# EAGLE schematic atx_power_control (EAGLE 9.6.1)
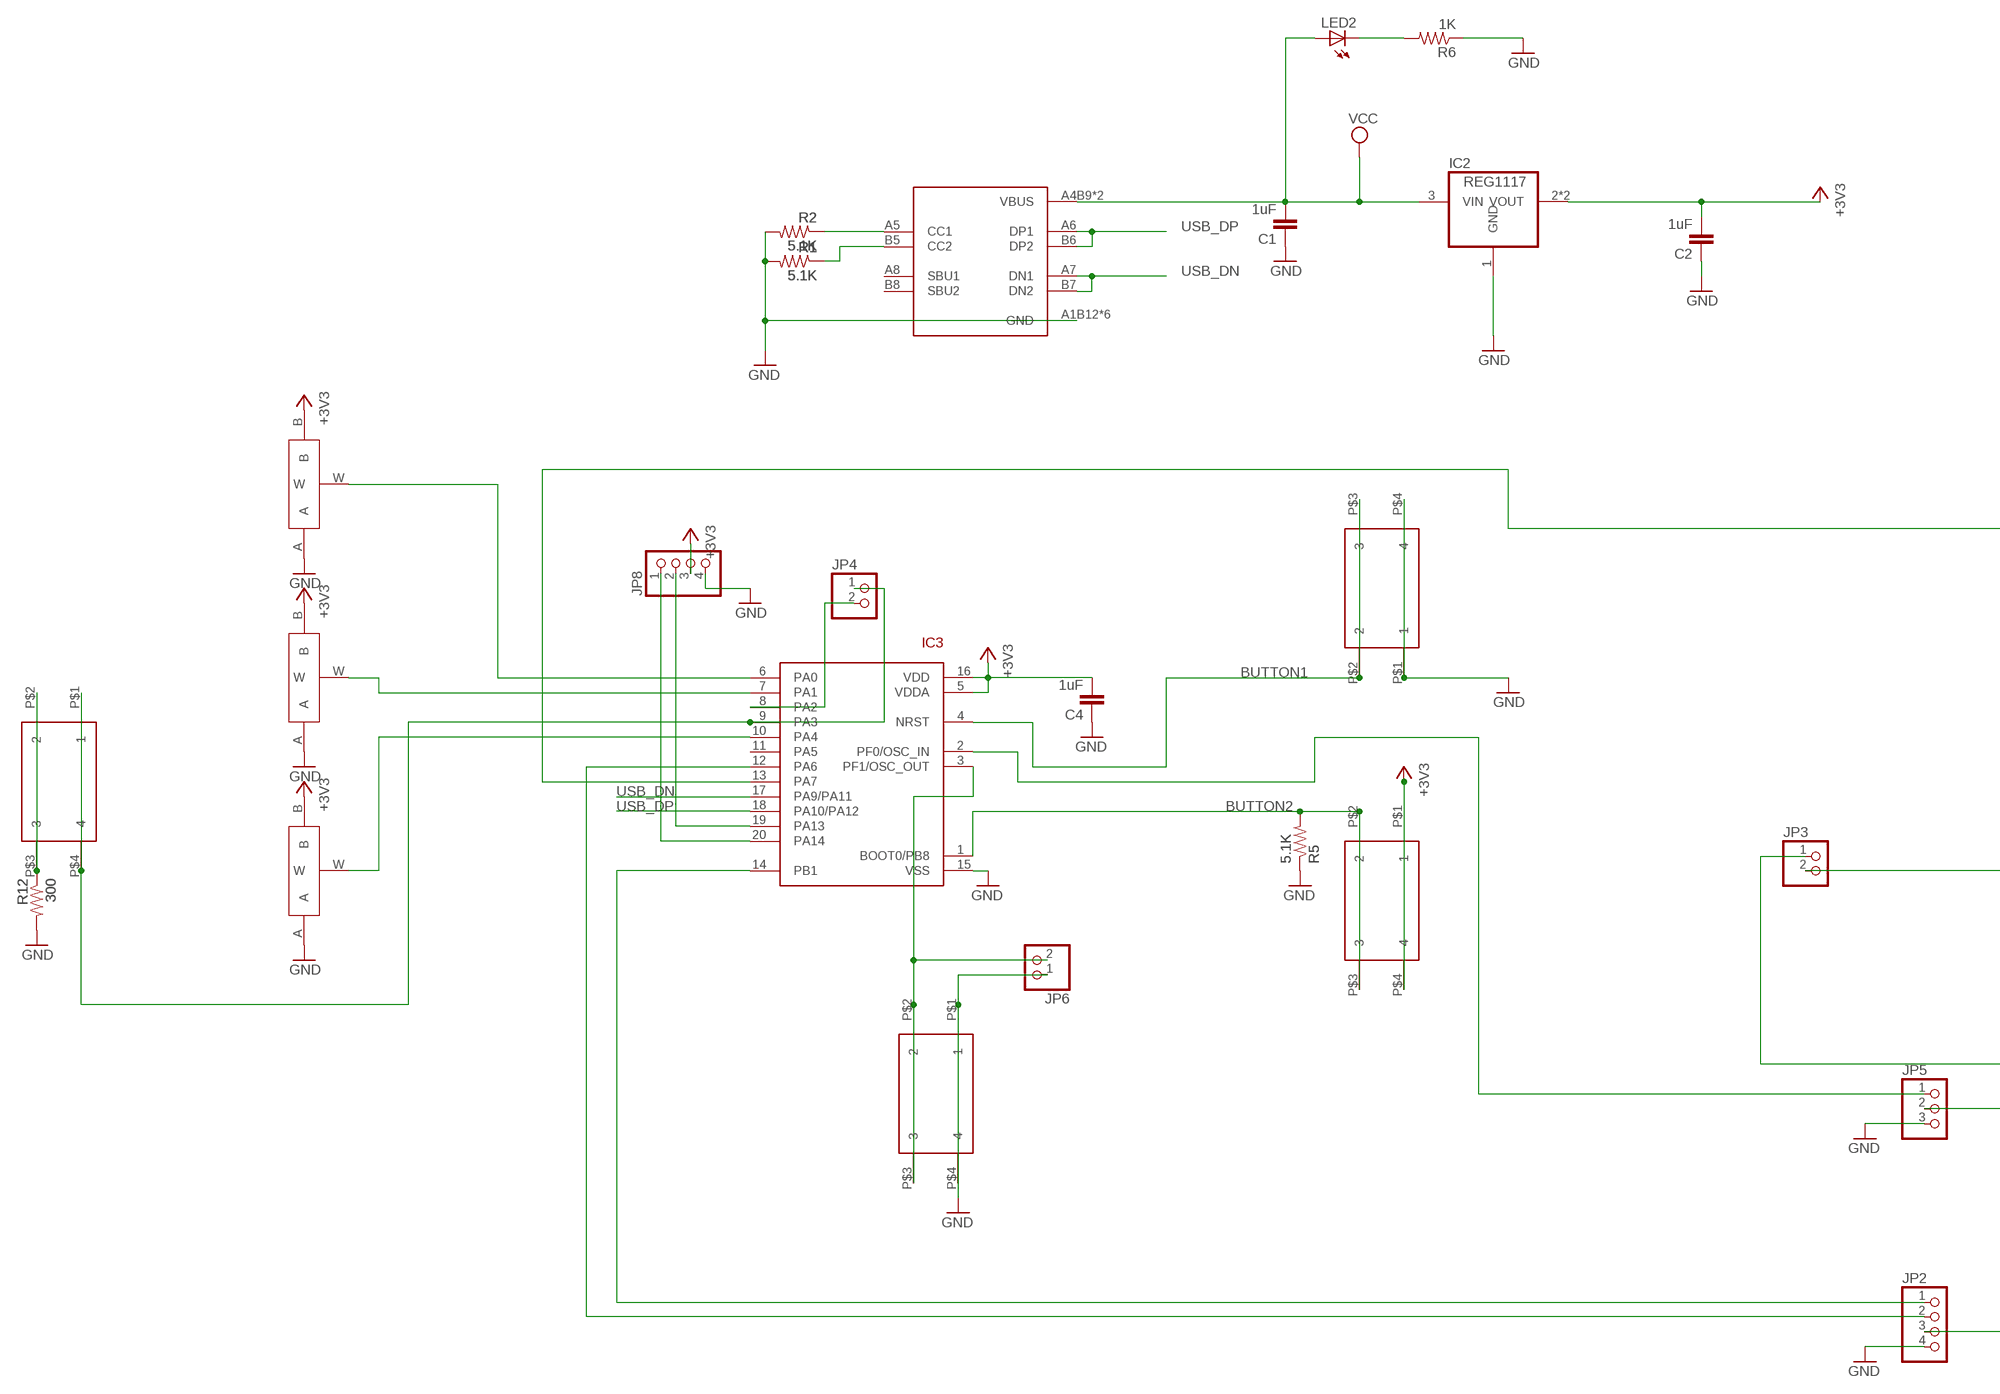
[diagram p0: schematic, sheet 1, part 1 of 2]
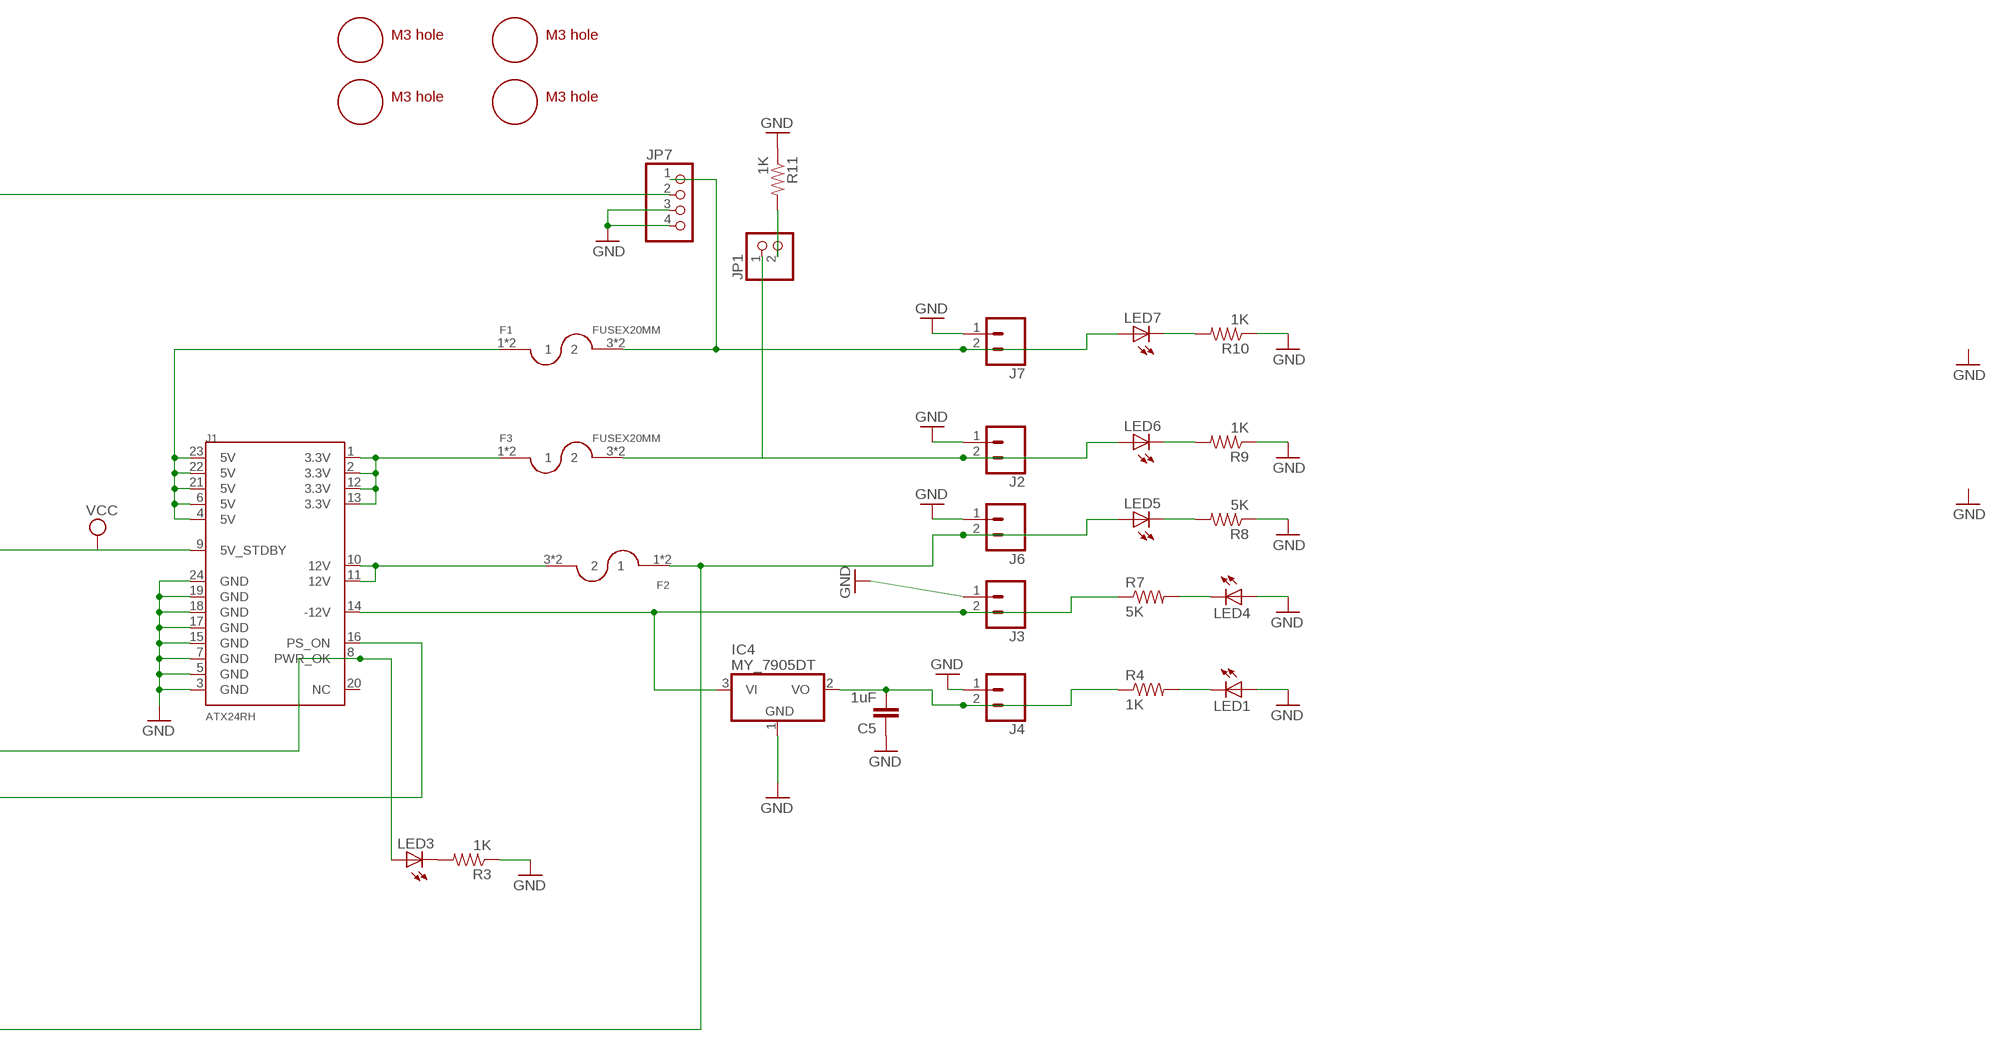
[diagram p1: schematic, sheet 1, part 2 of 2]

## Parts
C1  1uF  CAP0805  [0805@1]
C2  1uF  CAP0805  [0805@1]
C4  1uF  CAP0805  [0805@1]
C5  1uF  CAP0805  [0805@1]
F1  FUSEX20MM  [FUSE_5MM]
F2  FUSEX20MM  [FUSE_5MM]
F3  FUSEX20MM  [FUSE_5MM]
IC2  REG1117  [SOT223]
IC3  STM32F042F4  [TSSOP20]
IC4  MY_7905DT  [ADAFRUIT_TO252]
J1  ATX24RH  [ATX24_RIGHT_ANGLE]
J2  CONN_023.5MM  [SCREWTERMINAL-3.5MM-2]
J3  CONN_023.5MM  [SCREWTERMINAL-3.5MM-2]
J4  CONN_023.5MM  [SCREWTERMINAL-3.5MM-2]
J6  CONN_023.5MM  [SCREWTERMINAL-3.5MM-2]
J7  CONN_023.5MM  [SCREWTERMINAL-3.5MM-2]
JP1  PINHD-1X2  [1X02]
JP2  PINHD-1X4  [1X04]
JP3  PINHD-1X2  [1X02]
JP4  PINHD-1X2  [1X02]
JP5  PINHD-1X3  [1X03]
JP6  PINHD-1X2  [1X02]
JP7  PINHD-1X4  [1X04]
JP8  PINHD-1X4  [1X04]
LED1  LEDCHIP-LED0805  [CHIP-LED0805]
LED2  LEDCHIP-LED0805  [CHIP-LED0805]
LED3  LEDCHIP-LED0805  [CHIP-LED0805]
LED4  LEDCHIP-LED0805  [CHIP-LED0805]
LED5  LEDCHIP-LED0805  [CHIP-LED0805]
LED6  LEDCHIP-LED0805  [CHIP-LED0805]
LED7  LEDCHIP-LED0805  [CHIP-LED0805]
R1  5.1K  RESISTOR0805-RES  [0805]
R2  5.1K  RESISTOR0805-RES  [0805]
R3  1K  RESISTOR0805-RES  [0805]
R4  1K  RESISTOR0805-RES  [0805]
R5  5.1K  RESISTOR0805-RES  [0805]
R6  1K  RESISTOR0805-RES  [0805]
R7  5K  RESISTOR0805-RES  [0805]
R8  5K  RESISTOR0805-RES  [0805]
R9  1K  RESISTOR0805-RES  [0805]
R10  1K  RESISTOR0805-RES  [0805]
R11  1K  RESISTOR0805-RES  [0805]
R12  300  RESISTOR0805-RES  [0805]
SW1  324_SW  [342_SWICH_FOOT]
SW2  324_SW  [342_SWICH_FOOT]
SW3  324_SW  [342_SWICH_FOOT]
SW4  324_SW  [342_SWICH_FOOT]
U2  USBC_16P  [USBC_16P_FOOT]
U$1  M3_MOUNTING_HOLE  [M3_MOUNTING_HOLE_PACK]
U$2  M3_MOUNTING_HOLE  [M3_MOUNTING_HOLE_PACK]
U$3  M3_MOUNTING_HOLE  [M3_MOUNTING_HOLE_PACK]
U$4  3386P  [3386P]
U$5  3386P  [3386P]
U$6  3386P  [3386P]
U$10  M3_MOUNTING_HOLE  [M3_MOUNTING_HOLE_PACK]

## Nets
+3V3: C2.2 C4.2 IC2.2(VOUT) IC2.4(VOUT) IC3.5(VDDA) IC3.16(VDD) JP8.3 SW4.P$1 SW4.P$4 U$4.B U$5.B U$6.B
BUTTON1: IC3.4(NRST) SW3.P$2 SW3.P$3
BUTTON2: IC3.1(BOOT0/PB8) R5.2 SW4.P$2 SW4.P$3
GND: C1.1 C2.1 C4.1 C5.1 IC2.1(GND) IC3.15(VSS) IC4.1(GND) J1.3(GND) J1.5(GND) J1.7(GND) J1.15(GND) J1.17(GND) J1.18(GND) J1.19(GND) J1.24(GND) J2.1 J3.1 J4.1 J6.1 J7.1 JP2.4 JP5.3 JP6.1 JP7.3 JP7.4 JP8.4 LED1.A LED4.A R1.2 R2.2 R3.1 R5.1 R6.1 R8.1 R9.1 R10.1 R11.1 R12.2 SW1.P$1 SW1.P$4 SW3.P$1 SW3.P$4 U2.A1B12(GND) U2.B11A12(GND) U2.P$13(GND) U2.P$14(GND) U2.P$15(GND) U2.P$16(GND) U$4.A U$5.A U$6.A
N$1: LED3.C R3.2
N$2: IC4.3(VI) J1.14(-12V) J3.2 R7.1
N$3: IC3.20(PA14) JP8.1
N$4: IC3.19(PA13) JP8.2
N$5: LED1.C R4.2
N$6: IC3.12(PA6) JP2.2
N$7: IC3.14(PB1) JP2.1
N$8: LED4.C R7.2
N$9: LED5.C R8.2
N$10: F1.1 F1.2 J1.4(5V) J1.6(5V) J1.21(5V) J1.22(5V) J1.23(5V)
N$11: C5.2 IC4.2(VO) J4.2 R4.1
N$12: F3.1 F3.2 J1.1(3.3V) J1.2(3.3V) J1.12(3.3V) J1.13(3.3V)
N$13: IC3.6(PA0) U$4.W
N$14: IC3.13(PA7) JP7.2
N$15: F1.3 F1.4 J7.2 JP7.1 LED7.A
N$16: F2.1 F2.2 J6.2 JP2.3 LED5.A
N$17: JP1.2 R11.2
N$18: LED6.C R9.2
N$19: F3.3 F3.4 J2.2 JP1.1 LED6.A
N$20: LED7.C R10.2
N$21: F2.3 F2.4 J1.10(12V) J1.11(12V)
N$22: IC3.7(PA1) U$5.W
N$23: IC3.10(PA4) U$6.W
N$24: IC3.2(PF0/OSC_IN) JP5.1
N$25: J1.16(PS_ON) JP5.2
N$26: IC3.3(PF1/OSC_OUT) JP6.2 SW1.P$2 SW1.P$3
N$27: IC3.8(PA2) JP4.2
N$28: J1.8(PWR_OK) JP3.1 LED3.A
N$29: LED2.C R6.2
N$30: IC3.9(PA3) JP4.1 SW2.P$1 SW2.P$4
N$31: R1.1 U2.B5(CC2)
N$32: R12.1 SW2.P$2 SW2.P$3
N$33: R2.1 U2.A5(CC1)
USB_DN: IC3.17(PA9/PA11) U2.A7(DN1) U2.B7(DN2)
USB_DP: IC3.18(PA10/PA12) U2.A6(DP1) U2.B6(DP2)
VCC: C1.2 IC2.3(VIN) J1.9(5V_STDBY) JP3.2 LED2.A U2.A4B9(VBUS) U2.B4A9(VBUS)
Unconnected: IC3.11(PA5) J1.20(NC) U2.A8(SBU1) U2.B8(SBU2)

## Library data of the parts
C1 C2 C4 C5 = clock:CAP: Capacitor Standard 0603 ceramic capacitor, and 0.1" leaded capacitor.
F1-F3 = atx_power_control:FUSE
IC2 = clock:REG1117: 800mA and 1A Low Dropout (LDO) Positive Regulator 1.8V, 2.5V, 2.85V, 3.3V, 5V, and Adj; MPN: REG1117; OC_FARNELL: 1097566; OC_NEWARK: 14P6981
IC3 = tx:STM32F042F4
IC4 = atx_power_control:MY_7905: Positive VOLTAGE REGULATOR Added bigger pads to the TO-92 package
J1 = SparkFun-Connectors:ATX24: ATX24 Pin Power Supply Connector This is a good connector for connecting a computer power supply to a PCB. It's massive, but provides many amps of power at 5V and 12V. SKU: PRT-09498
J2-J4 J6 J7 = atx_power_control:CONN_02: Multi connection point. Often used as Generic Header-pin footprint for 0.1 inch spaced/style header connections On any of the 0.1 inch spaced packages, you can populate with these: Break Away Headers - Straight <https://www.sparkfun.com/products/116> (PRT-00116) Break Away Male Headers - Right Angle <https://www.sparkfun.com/products/553> (PRT-00553) Female Headers <https://www.sparkfun.com/products/115> (PRT-00115) Break Away Headers - Machine Pin <https://www.sparkfun.com/products/117> (PRT-00117) Break Away Female Headers - Swiss Machine Pin <https://www.sparkfun.com/products/743> (PRT-00743) For SCREWTERMINALS and SPRING TERMINALS visit here: Screw Terimnals on SparkFun.com <https://www.sparkfun.com/search/results?term=Screw+Terminals> (5mm/3.5mm/2.54mm spacing) This device is also useful as a general connection point to wire up your design to another part of your project. Our various solder wires solder well into these plated through hole pads. Hook-Up Wire - Assortment (Stranded, 22 AWG) <https://www.sparkfun.com/products/11375> (PRT-11375) Hook-Up Wire - Assortment (Solid Core, 22 AWG) <https://www.sparkfun.com/products/11367> (PRT-11367) View the entire wire category on our website here <https://www.sparkfun.com/categories/141> Special notes: Molex polarized connector foot print use with: PRT-08233 with associated crimp pins and housings. 2.54_SCREWTERM for use with PRT-10571. 3.5mm Screw Terminal footprints for PRT-08084 5mm Screw Terminal footprints for use with PRT-08432; PROD_ID: CONN-08399
JP1 JP3 JP4 JP6 = pinhead:PINHD-1X2: PIN HEADER
JP2 JP7 JP8 = pinhead:PINHD-1X4: PIN HEADER
JP5 = pinhead:PINHD-1X3: PIN HEADER
LED1-LED7 = adafruit:LED: LED OSRAM: - CHIPLED LG R971, LG N971, LY N971, LG Q971, LY Q971, LO R971, LY R971 LH N974, LH R974 LS Q976, LO Q976, LY Q976 LO Q996 - Hyper CHIPLED LW Q18S LB Q993, LB Q99A, LB R99A - SideLED LS A670, LO A670, LY A670, LG A670, LP A670 LB A673, LV A673, LT A673, LW A673 LH A674 LY A675 LS A676, LA A676, LO A676, LY A676, LW A676 LS A679, LY A679, LG A679 - Hyper Micro SIDELED® LS Y876, LA Y876, LO Y876, LY Y876 LT Y87S - SmartLED LW L88C, LW L88S LB L89C, LB L89S, LG L890 LS L89K, LO L89K, LY L89K LS L896, LA L896, LO L896, LY L896 - TOPLED LS T670, LO T670, LY T670, LG T670, LP T670 LSG T670, LSP T670, LSY T670, LOP T670, LYG T670 LG T671, LOG T671, LSG T671 LB T673, LV T673, LT T673, LW T673 LH T674 LS T676, LA T676, LO T676, LY T676, LB T676, LH T676, LSB T676, LW T676 LB T67C, LV T67C, LT T67C, LS T67K, LO T67K, LY T67K, LW E67C LS E67B, LA E67B, LO E67B, LY E67B, LB E67C, LV E67C, LT E67C LW T67C LS T679, LY T679, LG T679 LS T770, LO T770, LY T770, LG T770, LP T770 LB T773, LV T773, LT T773, LW T773 LH T774 LS E675, LA E675, LY E675, LS T675 LS T776, LA T776, LO T776, LY T776, LB T776 LHGB T686 LT T68C, LB T68C - Hyper Mini TOPLED® LB M676 - Mini TOPLED Santana® LG M470 LS M47K, LO M47K, LY M47K Source: http://www.osram.convergy.de/
R1 R2 R5 R12 = joyAnalog:RESISTOR: Resistor Basic schematic elements and footprints for 0603, 1206, and PTH resistors.
R3 R4 R6-R11 = SparkFun-Passives:RESISTOR: Resistor Basic schematic elements and footprints for 0603, 1206, and PTH resistors.
SW1-SW4 = 3pos_slide_switch_centered:324_SW
U2 = my_usbc_16p:USBC_16P
U$1-U$3 U$10 = a:M3_MOUNTING_HOLE
U$4-U$6 = bbc_micro:3386P